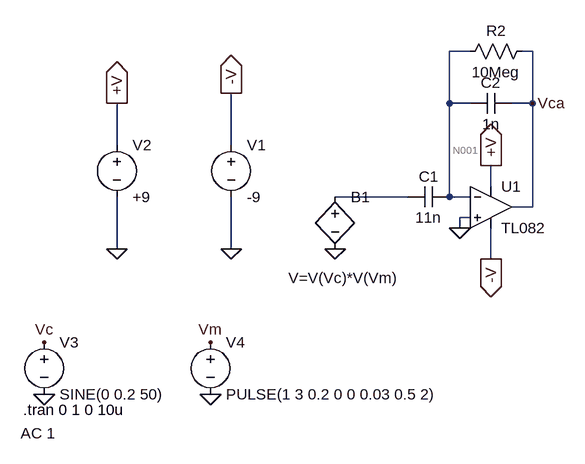
[diagram p0: schematic charge amplifier.asc]
* charge amplifier.asc
C2 Vca N001 1n
R2 Vca N001 10Meg
* U1: TL082 (symbol AutoGenerated\TL082 not available, pins judged from their places): In+=0 In-=N001 V+=+V V-=-V OUT=Vca
V1 -V 0 -9
V2 +V 0 +9
V3 Vc 0 SINE(0 0.2 50) AC 1
V4 Vm 0 PULSE(1 3 0.2 0 0 0.03 0.5 2)
B1 N002 0 V=V(Vc)*V(Vm)
C1 N001 N002 11n
.tran 0 1 0 10u
.backanno
.end

* Results of the author's LTspice run, read from the files saved beside the schematic
* Operating Point, zero values left out:
*   V(vca) = 401.5 µV
*   V(n001) = 10.97 µV
*   V(-v) = -9 V
*   V(+v) = 9 V
*   V(vm) = 1 V
*   I(R2) = 39.05 pA
*   I(V2) = -8.594 mA
*   I(V1) = 8.595 mA
*   Ix(u1:1) = 39.05 pA
*   Ix(u1:2) = 39.05 pA
*   Ix(u1:3) = 8.594 mA
*   Ix(u1:4) = -8.595 mA
*   Ix(u1:5) = -39.05 pA
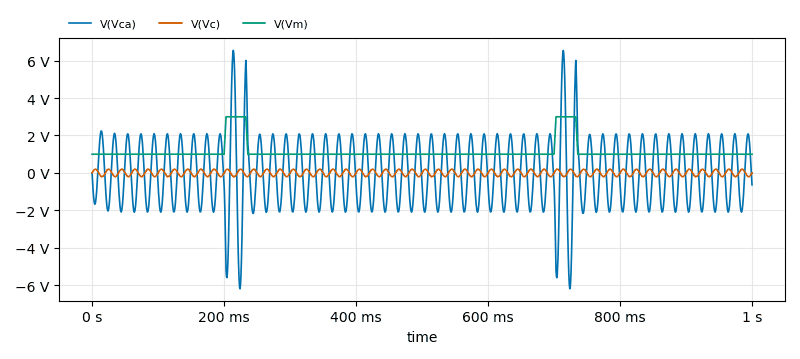
[diagram p1: Transient Analysis of charge amplifier.asc, plotted from the saved traces]
* Transient Analysis, 1 run:
*   V(Vca): min -6.187 V, max 6.546 V, average 6.746 mV, rms 1.824 V, last -635.1 mV
*   V(Vc): min -200 mV, max 200 mV, average -747.6 nV, rms 141 mV, last 0 V
*   V(Vm): min 999.8 mV, max 3 V, average 1.132 V, rms 1.233 V, last 1 V